# EAGLE design vibeBoard (EAGLE 5.06)
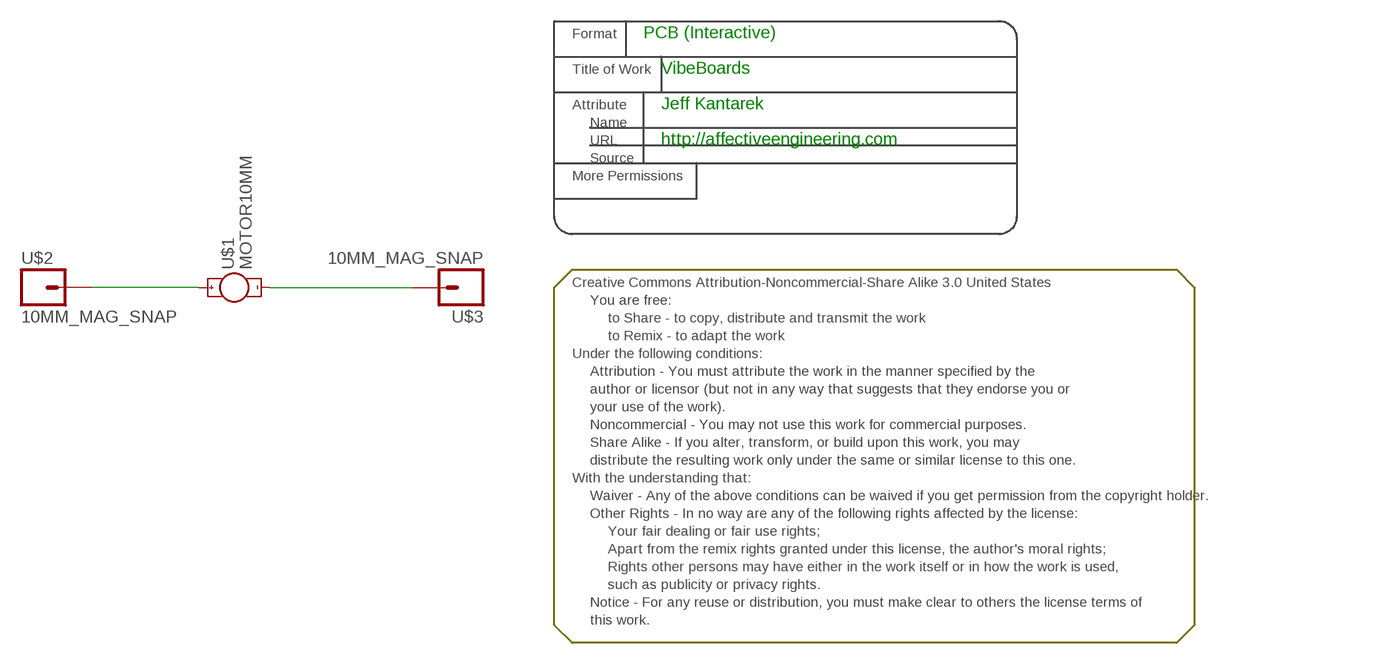
[diagram p0: schematic, sheet 1]

## Parts
U$1  MOTOR10MM  [VIBE-MOTOR-10MM]
U$2  10MM_MAG_SNAP  [SN1X01]
U$3  10MM_MAG_SNAP  [SN1X01]
U$4  CC_AT_NC_SA  [CC_AT_SA_NC]

## Nets
N$1: U$1.+ U$2.P$5
N$2: U$1.- U$3.P$5

## Notes on the sheet
- PCB (Interactive)
- VibeBoards
- Jeff Kantarek
- http://affectiveengineering.com

## Library data of the parts
U$1 = SparkFun:MOTOR: Vibration Motor Physical dimension and wire connections for this powerful vibration motor. Motor has a self adhesive backing. Spark Fun Electronics SKU : ROB-08449
U$2 U$3 = SparkFun:10MM_MAG_SNAP
U$4 = PumpingStation-One:CC_AT_NC_SA: Creative Commons Attribution-Noncommercial-Share Alike 3.0 United States us You are free: * to Share ? to copy, distribute and transmit the work * to Remix ? to adapt the work * Under the following conditions: * Attribution ? You must attribute the work in the manner specified by the author or licensor (but not in any way that suggests that they endorse you or your use of the work). Attribute this work: Information What does "Attribute this work" mean? The page you came from contained embedded licensing metadata, including how the creator wishes to be attributed for re-use. You can use the HTML here to cite the work. Doing so will also include metadata on your page so that others can find the original work as well. * Noncommercial ? You may not use this work for commercial purposes. * Share Alike ? If you alter, transform, or build upon this work, you may distribute the resulting work only under the same or similar license to this one. With the understanding that: * Waiver ? Any of the above conditions can be waived if you get permission from the copyright holder. * Other Rights ? In no way are any of the following rights affected by the license: o Your fair dealing or fair use rights; o Apart from the remix rights granted under this license, the author's moral rights; o Rights other persons may have either in the work itself or in how the work is used, such as publicity or privacy rights. * Notice ? For any reuse or distribution, you must make clear to others the license terms of this work. The best way to do this is with a link to this web page.

## Board
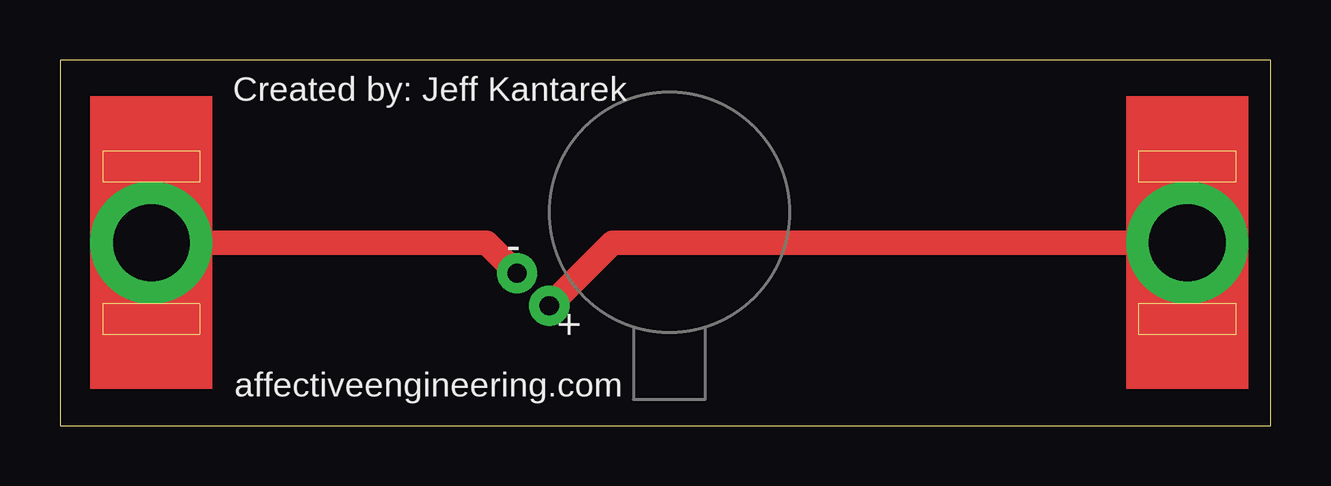
[diagram p1: board, top side]

Size 50.47 x 15.23 mm. Coordinates in mm from the lower left corner, seen from the top.
Outline: 0,0 50.47,0 50.47,15.23 0,15.23 0,0
Copper layers (1*16): Top 0.035mm / dielectric 1.5mm / Bottom 0.035mm
Design rules "default": minimum track width 10mil, minimum drill 24mil, track to track 8mil, track to pad 8mil, pad to pad 8mil, via to via 8mil, smd to smd 8mil, copper to edge 40mil, drill to drill 8mil, minimum pad ring 10mil, minimum via ring 8mil, stop-mask expansion 4mil, vias tented up to drill 0mil, thermal gap 10mil

### Footprints (pad centres in the part's own frame; a part is rotated, then mirrored left to right if it is on the bottom)
VIBE-MOTOR-10MM = drill 0.8 pad 1.676 round: + -5,-3.9; - -6.35,-2.54
SN1X01 = drill 3.2 pad 5.08 round: P$5 0,0

### Placement (x,y rotation side)
U$1  25.4,8.89 0 top
U$2  46.99,7.62 0 top
U$3  3.81,7.62 0 top
U$4  34.29,10.16 0 top

### Tracks (layer width: path | path; a pad name or v marks a point on that pad's centre or on a via)
N$1
  Top 1.016: U$2.P$5 23.03,7.62 U$1.+
N$2
  Top 1.016: U$3.P$5 17.78,7.62 U$1.-

### Text on the board
tNames: Created by: Jeff Kantarek | affectiveengineering.com